# Altium schematic sheet Main_Board_NFC.SchDoc
size A4
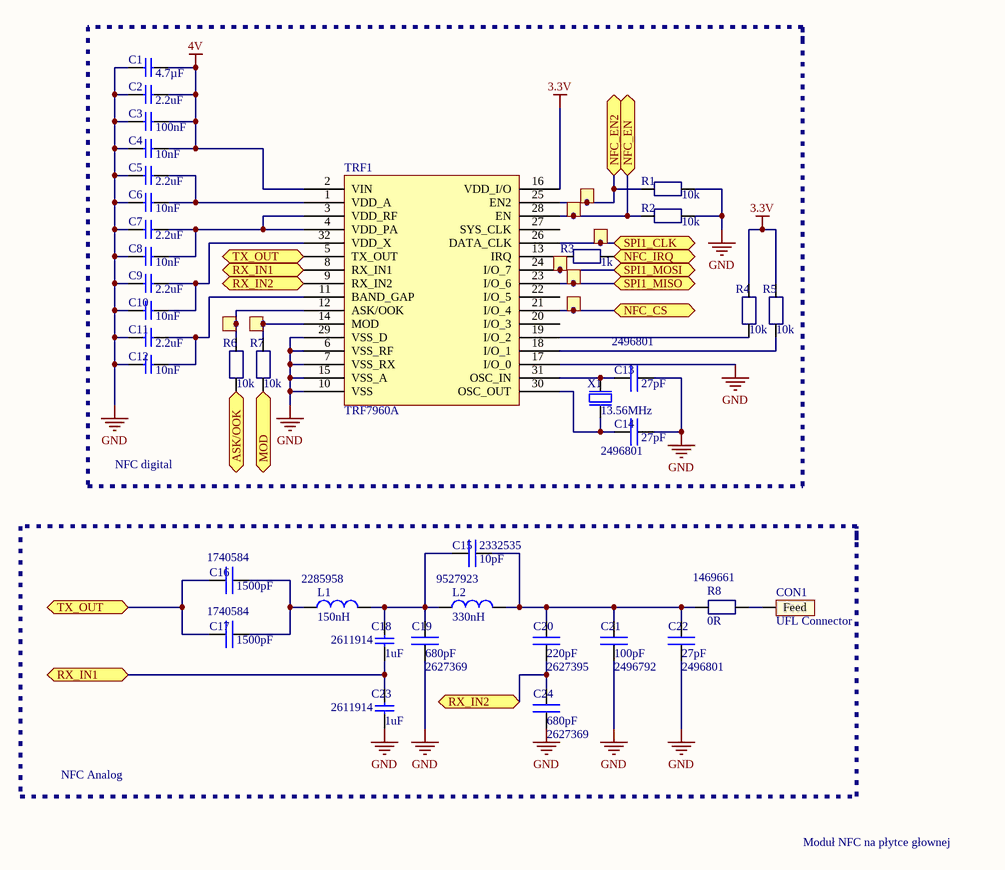
[diagram p0: Main_Board_NFC.SchDoc]

## Parts
C1  4.7µF  [0603]
C2  2.2uF  [0603]
C3  100nF  [0603]
C4  10nF  [0603]
C5  2.2uF  [0603]
C6  10nF  [0603]
C7  2.2uF  [0603]
C8  10nF  [0603]
C9  2.2uF  [0603]
C10  10nF  [0603]
C11  2.2uF  [0603]
C12  10nF  [0603]
C13  27pF  Supplier Part Number 1: 2496801  [0402]
C14  27pF  Supplier Part Number 1: 2496801  [0402]
C15  10pF  Supplier Part Number 1: 2332535  [0402]
C16  1500pF  Supplier Part Number 1: 1740584  [0402]
C17  1500pF  Supplier Part Number 1: 1740584  [0402]
C18  1uF  Supplier Part Number 1: 2611914  [0603]
C19  680pF  Supplier Part Number 1: 2627369  [0402]
C20  220pF  Supplier Part Number 1: 2627395  [0402]
C21  100pF  Supplier Part Number 1: 2496792  [0402]
C22  27pF  Supplier Part Number 1: 2496801  [0402]
C23  1uF  Supplier Part Number 1: 2611914  [0603]
C24  680pF  Supplier Part Number 1: 2627369  [0402]
CON1  UFL Connector  [UFL SMD]
L1  150nH  Supplier Part Number 1: 2285958  [0603]
L2  330nH  Supplier Part Number 1: 9527923  [0805]
R1  value 10k  [RES_0402]  (hidden comment: RES_0402_1k)
R2  value 10k  [RES_0402]  (hidden comment: RES_0402_1k)
R3  value 1k  [RES_0402]  (hidden comment: RES_0402_1k)
R4  value 10k  [RES_0402]  (hidden comment: RES_0402_1k)
R5  value 10k  [RES_0402]  (hidden comment: RES_0402_1k)
R6  value 10k  [RES_0402]  (hidden comment: RES_0402_1k)
R7  value 10k  [RES_0402]  (hidden comment: RES_0402_1k)
R8  value 0R  Supplier Part Number 2: 1469661  [RES_0402]  (hidden comment: RES_0402_1k)
TP1  TestPoint  [TEST_POINT_1mm]  (value not drawn)
TP2  TestPoint  [TEST_POINT_1mm]  (value not drawn)
TP3  TestPoint  [TEST_POINT_1mm]  (value not drawn)
TP4  TestPoint  [TEST_POINT_1mm]  (value not drawn)
TP5  TestPoint  [TEST_POINT_1mm]  (value not drawn)
TP6  TestPoint  [TEST_POINT_1mm]  (value not drawn)
TP7  TestPoint  [TEST_POINT_1mm]  (value not drawn)
TP8  TestPoint  [TEST_POINT_1mm]  (value not drawn)
TRF1  TRF7960A  [RHB32]
X1  13.56MHz  [XTAL_2016]

## Ports
ASK/OOK, MOD, NFC_CS, NFC_EN, NFC_EN2, NFC_IRQ, RX_IN1, RX_IN2, SPI1_CLK, SPI1_MISO, SPI1_MOSI, TX_OUT

## Nets
3.3V: R4.2 R5.2 TRF1.16(VDD_I/O)
4V: C1.2 C2.1 C3.2 C4.2 TRF1.2(VIN)
GND: C1.1 C2.2 C3.1 C4.1 C5.2 C6.1 C7.2 C8.1 C9.2 C10.1 C11.2 C12.1 C13.1 C14.1 C19.1 C21.1 C22.2 C23.2 C24.1 CON1.2(GND) R1.1 R2.1 TRF1.6(VSS_RF) TRF1.7(VSS_RX) TRF1.10(VSS) TRF1.15(VSS_A) TRF1.17(I/O_0) TRF1.29(VSS_D) X1.2(GND) X1.4(GND)
ASK/OOK: R6.1 ; port ASK/OOK
MOD: R7.1 ; port MOD
NFC_CS: TP6.1(TestPoint) TRF1.21(I/O_4) ; port NFC_CS
NFC_EN: R2.2 TP2.1(TestPoint) TRF1.28(EN) ; port NFC_EN
NFC_EN2: R1.2 TP1.1(TestPoint) TRF1.25(EN2) ; port NFC_EN2
NFC_IRQ: R3.2 ; port NFC_IRQ
RX_IN1: C18.2 C23.1 TRF1.8(RX_IN1) ; port RX_IN1
RX_IN2: C20.1 C24.2 TRF1.9(RX_IN2) ; port RX_IN2
SPI1_CLK: TP3.1(TestPoint) TRF1.26(DATA_CLK) ; port SPI1_CLK
SPI1_MISO: TP5.1(TestPoint) TRF1.23(I/O_6) ; port SPI1_MISO
SPI1_MOSI: TP4.1(TestPoint) TRF1.24(I/O_7) ; port SPI1_MOSI
TX_OUT: C16.1 C17.1 TRF1.5(TX_OUT) ; port TX_OUT
NetC5_1: C5.1 C6.2 TRF1.1(VDD_A)
NetC7_1: C7.1 C8.2 TRF1.3(VDD_RF) TRF1.4(VDD_PA)
NetC9_1: C9.1 C10.2 TRF1.32(VDD_X)
NetC11_1: C11.1 C12.2 TRF1.11(BAND_GAP)
NetC13_2: C13.2 TRF1.31(OSC_IN) X1.3(out)
NetC14_2: C14.2 TRF1.30(OSC_OUT) X1.1(inp)
NetC15_1: C15.1 C20.2 C21.2 C22.1 L2.2 R8.2
NetC15_2: C15.2 C18.1 C19.2 L1.2 L2.1
NetC16_2: C16.2 C17.2 L1.1
NetCON1_1: CON1.1(Feed) R8.1
NetR3_1: R3.1 TRF1.13(IRQ)
NetR4_1: R4.1 TRF1.19(I/O_2)
NetR5_1: R5.1 TRF1.18(I/O_1)
NetR6_2: R6.2 TP7.1(TestPoint) TRF1.12(ASK/OOK)
NetR7_2: R7.2 TP8.1(TestPoint) TRF1.14(MOD)

Not connected (* = marked no-connect by the designer): TRF1 20(I/O_3) 22(I/O_5) 27(SYS_CLK)

## Notes on the sheet
- NFC digital
- NFC Analog
- Moduł NFC na płytce głownej

## Library data of the parts
C1 = C0603-4µ7: Capacitor, X5R, ±10%; Note: 6.3V; Artikkelnr Noca: 20069060; Artikkelnr Simpro: N.A.; Part Number: C0603-4µ7; Manufacturer: *; Manufacturer Part Number: *; Datasheet: *; LatestRevisionDate: 2009-11-23; Pin Count: 2; Publisher: Nordic Semiconductor; Published: 2009-05-08; Value: 4.7µF; Supplier: *; Supplier part number: *; 2nd source Supplier: *; 2nd source part number: *; Footprint Doc: 0603
C2 C5 C7 C9 C11 C18 C23 = C0603-4µ7: Capacitor, X5R, ±10%; Value: 4.7µF; Note: 6.3V; Artikkelnr Noca: 20069060; Artikkelnr Simpro: N.A.; Part Number: C0603-4µ7; Manufacturer: *; Manufacturer Part Number: *; Datasheet: *; LatestRevisionDate: 2009-11-23; Pin Count: 2; Publisher: Nordic Semiconductor; Published: 2009-05-08; Supplier: *; Supplier part number: *; 2nd source Supplier: *; 2nd source part number: *; Footprint Doc: 0603
  C18 C23: Supplier 1: Farnell
C3 = C0201-100n: Capacitor, X7R, ±10%; Note: 16V; Artikkelnr Noca: N.A.; Part Number: C0201-100n; Manufacturer: *; Manufacturer Part Number: *; Datasheet: *; LatestRevisionDate: 2014-11-13; Pin Count: 2; Publisher: Nordic Semiconductor; Published: 2014-11-13; Value: 100nF; Supplier: *; Supplier part number: *; 2nd source Supplier: *; 2nd source part number: *; Footprint Doc: 0201; Artikkelnr Simpro: N.A.
C4 C6 C8 C10 C12 = C0201-100n: Capacitor, X7R, ±10%; Value: 100nF; Note: 16V; Artikkelnr Noca: N.A.; Part Number: C0201-100n; Manufacturer: *; Manufacturer Part Number: *; Datasheet: *; LatestRevisionDate: 2014-11-13; Pin Count: 2; Publisher: Nordic Semiconductor; Published: 2014-11-13; Supplier: *; Supplier part number: *; 2nd source Supplier: *; 2nd source part number: *; Footprint Doc: 0201; Artikkelnr Simpro: N.A.
C13-C17 C19-C22 C24 = Capacitor_MLCC: ?; Supplier 1: Farnell
L1 L2 = Inductor: Supplier 1: Farnell
X1 = XTAL_SMD2016_32MHz_8pF_Epson: XTAL SMD 2016, 32MHz, Cl=8pF, Total Tol: ±40ppm; Manufacturer: Epson Toyocom; Manufacturer Part Number: Q22FA12800025; Note: XTAL SMD 32.000MHz; Artikkelnr Noca: N.A.; Part Number: XTAL_SMD2016_32MHz_8pF_Epson; Datasheet: http://www.epsondevice.com/docs/qd/en/DownloadServlet?id=ID000449; LatestRevisionDate: 2014-11-27; Pin Count: 4; Publisher: Nordic Semiconductor; Published: 2012-03-09; Value: 32MHz; Supplier: Farnell; Supplier part number: 171-2806; 2nd source Supplier: *; 2nd source part number: *; Footprint Doc: XTAL_2016; Artikkelnr Simpro: N.A.
CON1 = UFL Connector: Supplier 1: Digi-Key; Supplier 2: Digi-Key; Supplier 3: Digi-Key; Supplier 4: Digi-Key; Supplier 5: Digi-Key; Supplier 6: Digi-Key; Supplier 7: Farnell; Supplier 8: Farnell; Supplier Part Number 1: H9161DKR-ND; Supplier Part Number 2: H11891CT-ND; Supplier Part Number 3: H11891DKR-ND; Supplier Part Number 4: H9161CT-ND; Supplier Part Number 5: H9161TR-ND; Supplier Part Number 6: H11891TR-ND; Supplier Part Number 7: 1688077; Supplier Part Number 8: 1688077RL
R1-R8 = RES_0402_1k: Supplier 2: Farnell
  R1-R7: Supplier 1: Digi-Key; Supplier 3: Mouser; Supplier Part Number 1: 311-1.0KJRTR-ND; Supplier Part Number 2: 1358043; Supplier Part Number 3: 603-RC0402FR-071KL
  R8: Supplier 1: Mouser; Supplier Part Number 1: 603-RC0402FR-071KL